# Altium schematic sheet SkyPulseUAV_Connector.SchDoc
size A4; SheetNumber: 5; SheetTotal: 5
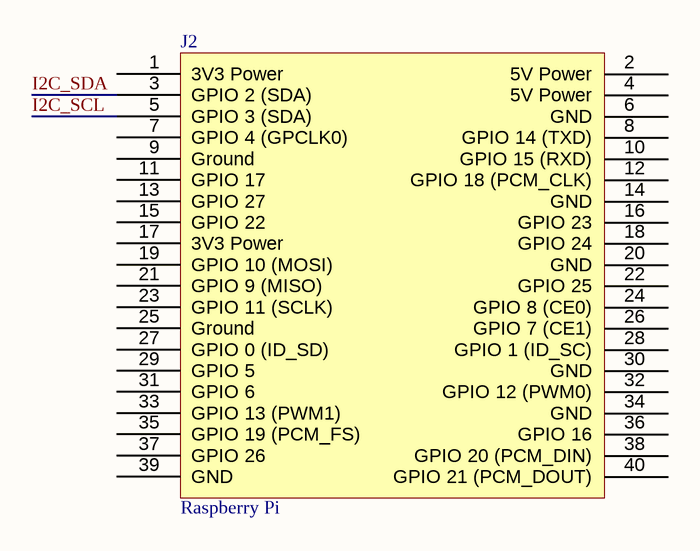
[diagram p0: SkyPulseUAV_Connector.SchDoc]

## Parts
J2  Raspberry Pi

## Nets
I2C_SCL: J2.5(GPIO_3_(SDA))
I2C_SDA: J2.3(GPIO_2_(SDA))

Not connected (* = marked no-connect by the designer): J2 1(3V3_Power) 2(5V_Power) 4(5V_Power) 6(GND) 7(GPIO_4_(GPCLK0)) 8(GPIO_14_(TXD)) 9(Ground) 10(GPIO_15_(RXD)) 11(GPIO_17) 12(GPIO_18_(PCM_CLK)) 13(GPIO_27) 14(GND) 15(GPIO_22) 16(GPIO_23) 17(3V3_Power) 18(GPIO_24) 19(GPIO_10_(MOSI)) 20(GND) 21(GPIO_9_(MISO)) 22(GPIO_25) 23(GPIO_11_(SCLK)) 24(GPIO_8_(CE0)) 25(Ground) 26(GPIO_7_(CE1)) 27(GPIO_0_(ID_SD)) 28(GPIO_1_(ID_SC)) 29(GPIO_5) 30(GND) 31(GPIO_6) 32(GPIO_12_(PWM0)) 33(GPIO_13_(PWM1)) 34(GND) 35(GPIO_19_(PCM_FS)) 36(GPIO_16) 37(GPIO_26) 38(GPIO_20_(PCM_DIN)) 39(GND) 40(GPIO_21_(PCM_DOUT))

## Notes on the sheet
- TITLE:
- SIZE
- AUTHOR:
- REVISION:
- DATA:
- FILE NAME:
- A4
- SHEET
- OF

## Library data of the parts
J2 = Raspberry Pi Connector: Raspberry Pi Connector, 40P